# EAGLE design WheatstonebridgePCB (EAGLE 9.6.2)
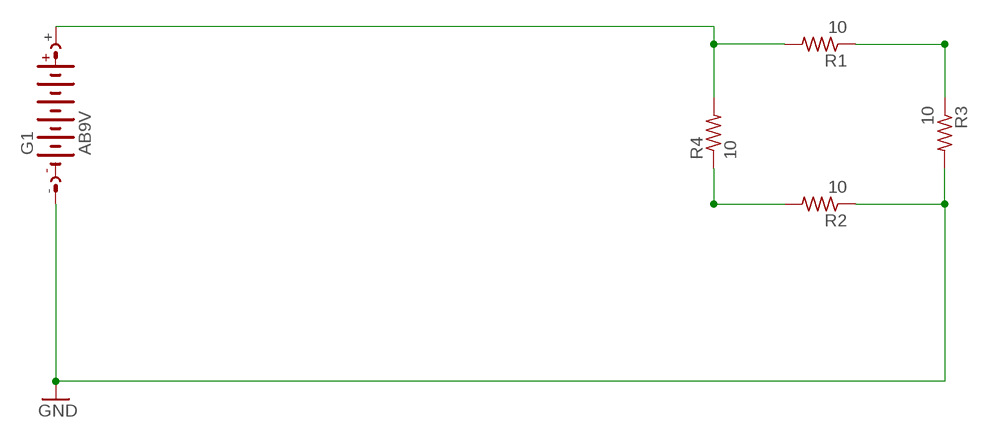
[diagram p0: schematic, sheet 1]

## Parts
G1  AB9V  [AB9V]
R1  10  R-US_R0805  [R0805]
R2  10  R-US_R0805  [R0805]
R3  10  R-US_R0805  [R0805]
R4  10  R-US_R0805  [R0805]

## Nets
GND: G1.- R2.1 R3.2
N$2: G1.+ R1.2 R4.2
N$3: R1.1 R3.1
N$4: R2.2 R4.1

## Library data of the parts
G1 = battery:AB9V: 9-V BATTERY CLIP
R1-R4 = rcl:R-US_: RESISTOR, American symbol; SPICEPREFIX: R

## Board
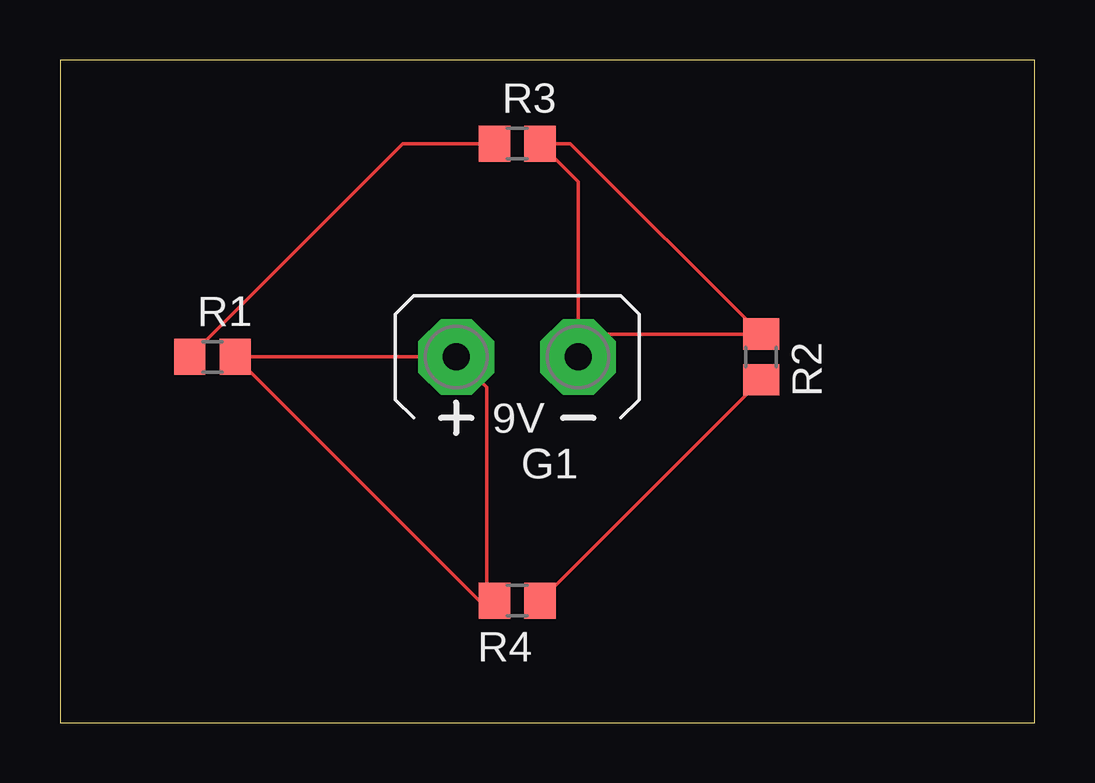
[diagram p1: board, top side]

Size 40.62 x 27.61 mm. Coordinates in mm from the lower left corner, seen from the top.
Outline: 0,0 40.62,0 40.62,27.61 0,27.61 0,0
Copper layers (1*16): Top 0.035mm / dielectric 1.5mm / Bottom 0.035mm
Design rules "default": minimum track width 6mil, minimum drill 0.35mm, track to track 6mil, track to pad 6mil, pad to pad 6mil, via to via 6mil, smd to smd 6mil, copper to edge 40mil, drill to drill 6mil, minimum pad ring 10mil, minimum via ring 8mil, stop-mask expansion 4mil, vias tented up to drill 0mil, thermal gap 10mil

### Footprints (pad centres in the part's own frame; a part is rotated, then mirrored left to right if it is on the bottom)
AB9V = drill 1.118 pad 3.15 octagon: + 0,2.54; - 0,-2.54
R0805 = smd 1.3 x 1.5: 1 -0.95,0; 2 0.95,0

### Placement (x,y rotation side)
G1  19.05,15.24 90 top
R1  6.35,15.24 0 top
R2  29.21,15.24 270 top
R3  19.05,24.13 0 top
R4  19.05,5.08 180 top

### Tracks (layer width: path | path; a pad name or v marks a point on that pad's centre or on a via)
GND
  Top 0.152: G1.- 22.54,16.19 R2.1 21.27,24.13 R3.2 21.59,22.54 G1.- | G1.- 21.59,13.97
N$2
  Top 0.152: 17.78,5.08 17.46,5.08 R1.2 G1.+ 17.78,13.97 17.78,5.08 | 17.78,5.08 R4.2
N$3
  Top 0.152: R1.1 14.29,24.13 R3.1
N$4
  Top 0.152: R4.1 R2.2